# EAGLE design WT (EAGLE 9.0.1)
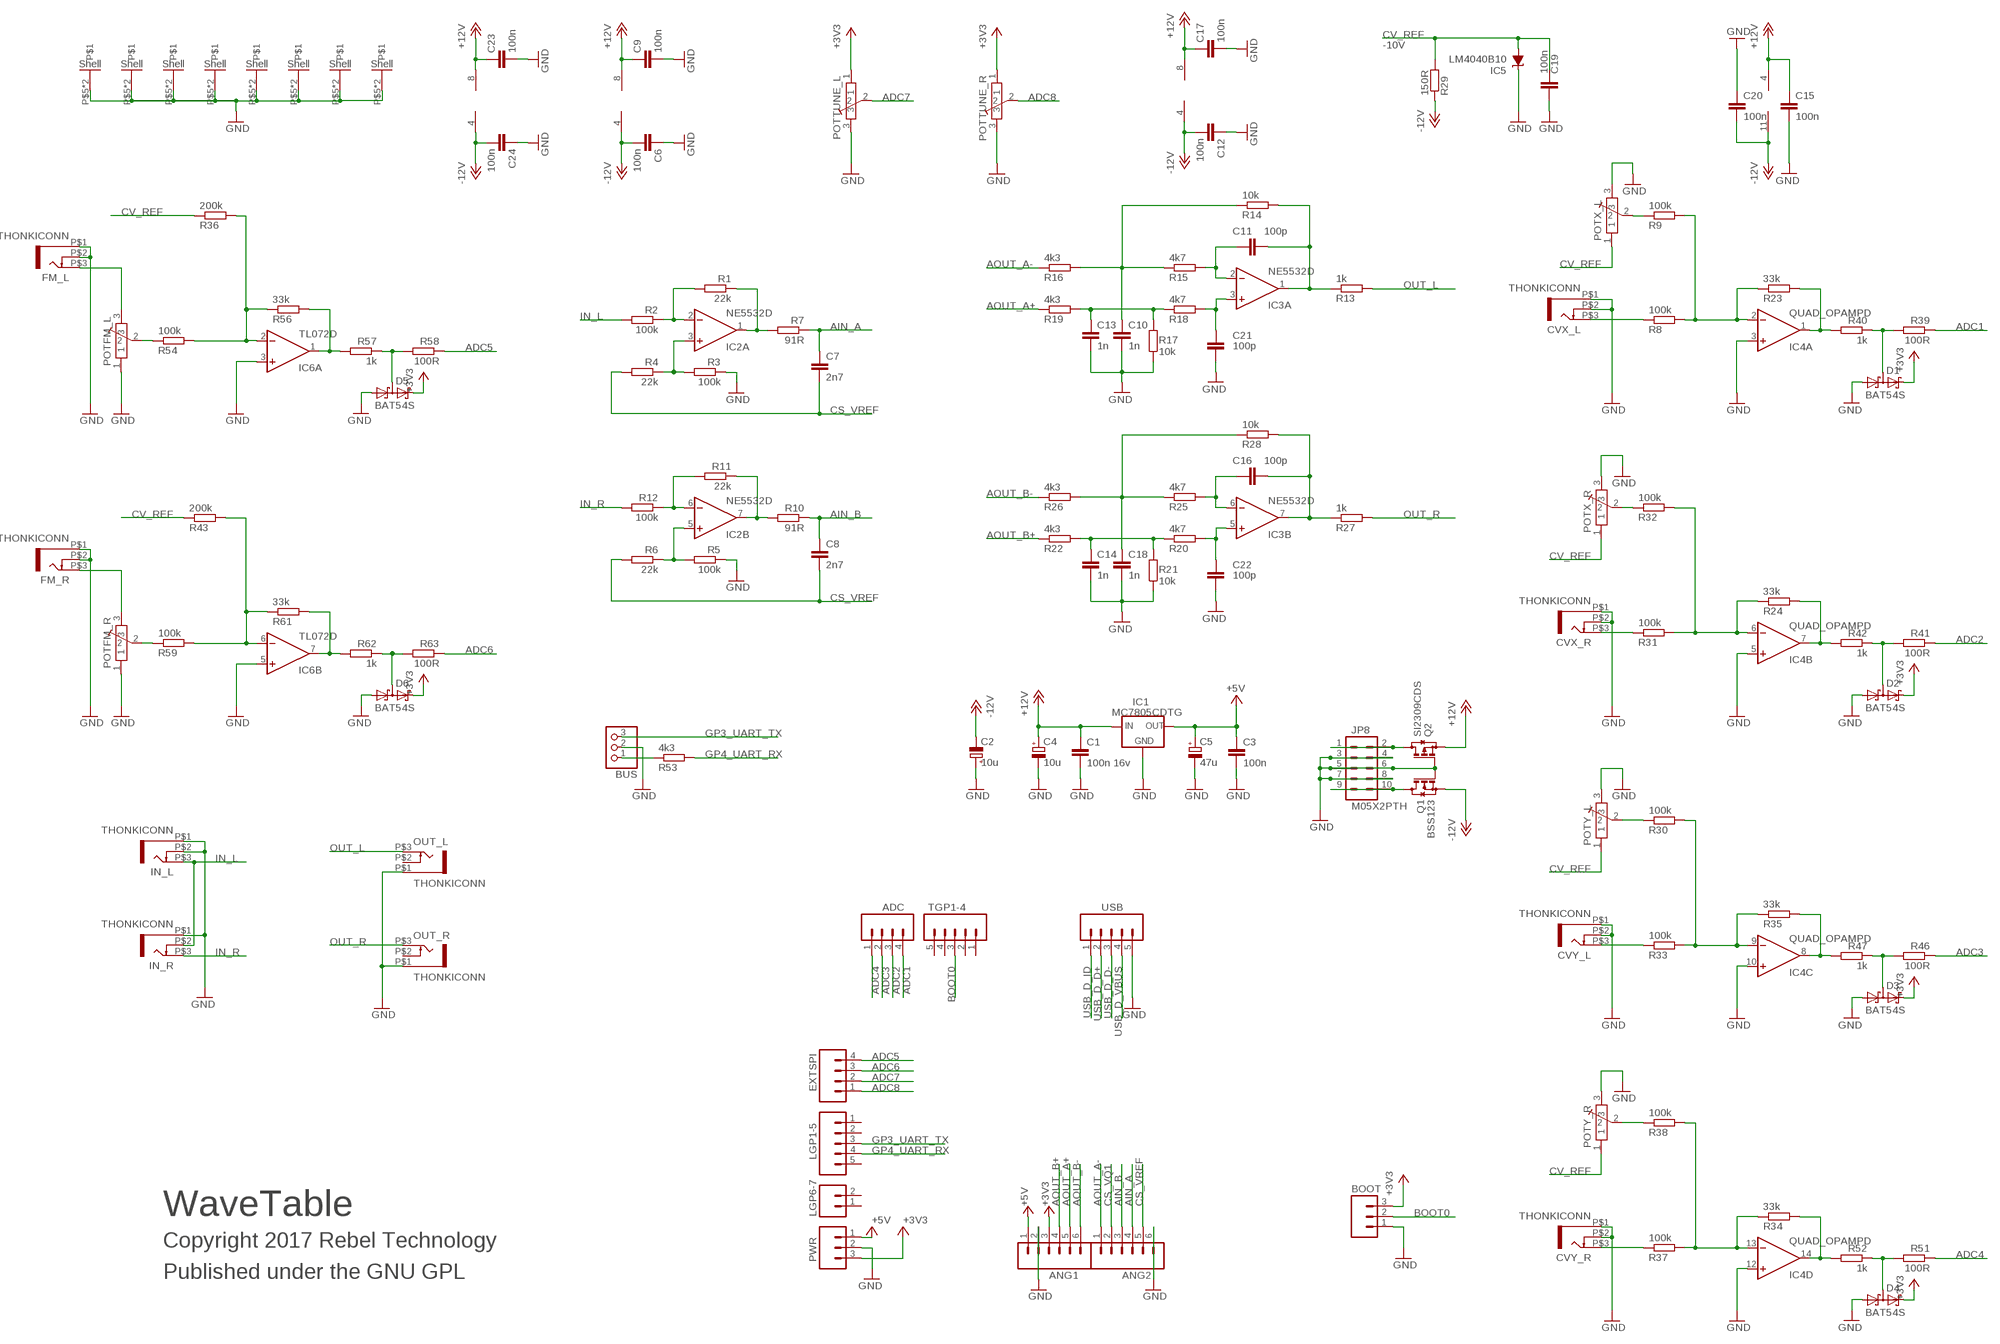
[diagram p0: schematic, sheet 1]

## Parts
ADC  M04PTH  [1X04]
ANG1  M06SIP  [1X06]
ANG2  M06SIP  [1X06]
BOOT  M03PTH  [1X03]
BUS  CON-JST-1X03PH-TH  [JST-B3B-PH-KL]
C1  100n 16v  C-EUC0603  [C0603]
C2  10u  CPOL-EU153CLV-0505  [CPOL-5]
C3  100n  C-EUC0603  [C0603]
C4  10u  CPOL-EU153CLV-0505  [CPOL-5]
C5  47u  CPOL-EUC  [PANASONIC_C]
C6  100n  C-EUC0603  [C0603]
C7  2n7  C-EUC0603  [C0603]
C8  2n7  C-EUC0603  [C0603]
C9  100n  C-EUC0603  [C0603]
C10  1n  C-EUC0603  [C0603]
C11  100p  C-EUC0603  [C0603]
C12  100n  C-EUC0603  [C0603]
C13  1n  C-EUC0603  [C0603]
C14  1n  C-EUC0603  [C0603]
C15  100n  C-EUC0603  [C0603]
C16  100p  C-EUC0603  [C0603]
C17  100n  C-EUC0603  [C0603]
C18  1n  C-EUC0603  [C0603]
C19  100n  C-EUC0603  [C0603]
C20  100n  C-EUC0603  [C0603]
C21  100p  C-EUC0603  [C0603]
C22  100p  C-EUC0603  [C0603]
C23  100n  C-EUC0603  [C0603]
C24  100n  C-EUC0603  [C0603]
CVX_L  THONKICONN  [THONKICONN]
CVX_R  THONKICONN  [THONKICONN]
CVY_L  THONKICONN  [THONKICONN]
CVY_R  THONKICONN  [THONKICONN]
D1  BAT54S  [SOT23]
D2  BAT54S  [SOT23]
D3  BAT54S  [SOT23]
D4  BAT54S  [SOT23]
D5  BAT54S  [SOT23]
D6  BAT54S  [SOT23]
EXTSPI  M04PTH  [1X04]
FM_L  THONKICONN  [THONKICONN]
FM_R  THONKICONN  [THONKICONN]
IC1  MC7805CDTG  MC78XX  [DPACK]
IC2  NE5532D  [SO08]
IC3  NE5532D  [SO08]
IC4  QUAD_OPAMPD  [SO14]
IC5  LM4040B10  LM4041C12DBZ  [DBZ_R-PDSO-G3]
IC6  TL072D  [SO08]
IN_L  THONKICONN  [THONKICONN]
IN_R  THONKICONN  [THONKICONN]
JP8  M05X2PTH  [AVR_ICSP]
LGP1-5  M05PTH  [1X05]
LGP6-7  M02PTH  [1X02]
OUT_L  THONKICONN  [THONKICONN]
OUT_R  THONKICONN  [THONKICONN]
POTFM_L  POT-ALPS-RK09L1140  [POT-ALPS-RK09L1140]
POTFM_R  POT-ALPS-RK09L1140  [POT-ALPS-RK09L1140]
POTTUNE_L  POT-ALPS-RK09L1140  [POT-ALPS-RK09L1140]
POTTUNE_R  POT-ALPS-RK09L1140  [POT-ALPS-RK09L1140]
POTX_L  POT-ALPS-RK09L1140  [POT-ALPS-RK09L1140]
POTX_R  POT-ALPS-RK09L1140  [POT-ALPS-RK09L1140]
POTY_L  POT-ALPS-RK09L1140  [POT-ALPS-RK09L1140]
POTY_R  POT-ALPS-RK09L1140  [POT-ALPS-RK09L1140]
PWR  M03PTH  [1X03]
Q1  BSS123  [SOT23]
Q2  SI2309CDS  BSS84  [SOT23]
R1  22k  R-EU_0603  [0603]
R2  100k  R-EU_0603  [0603]
R3  100k  R-EU_0603  [0603]
R4  22k  R-EU_0603  [0603]
R5  100k  R-EU_0603  [0603]
R6  22k  R-EU_0603  [0603]
R7  91R  R-EU_0603  [0603]
R8  100k  R-EU_0603  [0603]
R9  100k  R-EU_0603  [0603]
R10  91R  R-EU_0603  [0603]
R11  22k  R-EU_0603  [0603]
R12  100k  R-EU_0603  [0603]
R13  1k  R-EU_0603  [0603]
R14  10k  R-EU_0603  [0603]
R15  4k7  R-EU_0603  [0603]
R16  4k3  R-EU_0603  [0603]
R17  10k  R-EU_0603  [0603]
R18  4k7  R-EU_0603  [0603]
R19  4k3  R-EU_0603  [0603]
R20  4k7  R-EU_0603  [0603]
R21  10k  R-EU_0603  [0603]
R22  4k3  R-EU_0603  [0603]
R23  33k  R-EU_0603  [0603]
R24  33k  R-EU_0603  [0603]
R25  4k7  R-EU_0603  [0603]
R26  4k3  R-EU_0603  [0603]
R27  1k  R-EU_0603  [0603]
R28  10k  R-EU_0603  [0603]
R29  150R  R-EU_0603  [0603]
R30  100k  R-EU_0603  [0603]
R31  100k  R-EU_0603  [0603]
R32  100k  R-EU_0603  [0603]
R33  100k  R-EU_0603  [0603]
R34  33k  R-EU_0603  [0603]
R35  33k  R-EU_0603  [0603]
R36  200k  R-EU_0603  [0603]
R37  100k  R-EU_0603  [0603]
R38  100k  R-EU_0603  [0603]
R39  100R  R-EU_0603  [0603]
R40  1k  R-EU_0603  [0603]
R41  100R  R-EU_0603  [0603]
R42  1k  R-EU_0603  [0603]
R43  200k  R-EU_0603  [0603]
R46  100R  R-EU_0603  [0603]
R47  1k  R-EU_0603  [0603]
R51  100R  R-EU_0603  [0603]
R52  1k  R-EU_0603  [0603]
R53  4k3  R-EU_0603  [0603]
R54  100k  R-EU_0603  [0603]
R56  33k  R-EU_0603  [0603]
R57  1k  R-EU_0603  [0603]
R58  100R  R-EU_0603  [0603]
R59  100k  R-EU_0603  [0603]
R61  33k  R-EU_0603  [0603]
R62  1k  R-EU_0603  [0603]
R63  100R  R-EU_0603  [0603]
TGP1-4  M05PTH  [1X05]
USB  M05PTH  [1X05]

## Nets
+3V3: ANG1.3 BOOT.3 D1.2(C2) D2.2(C2) D3.2(C2) D4.2(C2) D5.2(C2) D6.2(C2) POTTUNE_L.1 POTTUNE_R.1 PWR.3
+5V: ANG1.1 C3.1 C5.+ IC1.3(OUT) PWR.1
+12V: C1.1 C4.+ C9.1 C15.1 C17.1 C23.1 IC1.1(IN) IC2.8(P:V+) IC3.8(P:V+) IC4.4(P:V+) IC6.8(P:V+) Q2.2(S)
-12V: C2.- C6.2 C12.2 C20.2 C24.2 IC2.4(P:V-) IC3.4(P:V-) IC4.11(P:V-) IC6.4(P:V-) Q1.2(S) R29.1
ADC1: ADC.4 R39.1
ADC2: ADC.3 R41.1
ADC3: ADC.2 R46.1
ADC4: ADC.1 R51.1
ADC5: EXTSPI.4 R58.1
ADC6: EXTSPI.3 R63.1
ADC7: EXTSPI.2 POTTUNE_L.2
ADC8: EXTSPI.1 POTTUNE_R.2
AIN_A: ANG2.4 C7.1 R7.1
AIN_B: ANG2.3 C8.1 R10.1
AOUT_A+: ANG1.5 R19.1
AOUT_A-: ANG2.1 R16.1
AOUT_B+: ANG1.4 R22.1
AOUT_B-: ANG1.6 R26.1
BOOT0: BOOT.2 TGP1-4.3
CS_VQ1: ANG2.2
CS_VREF: ANG2.5 C7.2 C8.2 R4.2 R6.2
CV_REF: C19.1 IC5.2(A) POTX_L.1 POTX_R.1 POTY_L.1 POTY_R.1 R29.2 R36.1 R43.1
EXT_UART_RX: BUS.1 R53.1
GND: ANG1.2 ANG2.6 BOOT.1 BUS.2 C1.2 C2.+ C3.2 C4.- C5.- C6.1 C9.2 C10.2 C12.1 C13.2 C14.2 C15.2 C17.2 C18.2 C19.2 C20.1 C21.2 C22.2 C23.2 C24.1 CVX_L.P$1 CVX_L.P$2 CVX_R.P$1 CVX_R.P$2 CVY_L.P$1 CVY_L.P$2 CVY_R.P$1 CVY_R.P$2 D1.1(A1) D2.1(A1) D3.1(A1) D4.1(A1) D5.1(A1) D6.1(A1) FM_L.P$1 FM_L.P$2 FM_R.P$1 FM_R.P$2 IC1.4(GND) IC4.3(A:+IN) IC4.5(B:+IN) IC4.10(C:+IN) IC4.12(D:+IN) IC5.1(C) IC6.3(A:+IN) IC6.5(B:+IN) IN_L.P$1 IN_L.P$2 IN_R.P$1 JP8.3 JP8.4 JP8.5 JP8.6 JP8.7 JP8.8 OUT_L.P$1 OUT_R.P$1 POTFM_L.1 POTFM_L.P$5 POTFM_L.P$6 POTFM_R.1 POTFM_R.P$5 POTFM_R.P$6 POTTUNE_L.3 POTTUNE_L.P$5 POTTUNE_L.P$6 POTTUNE_R.3 POTTUNE_R.P$5 POTTUNE_R.P$6 POTX_L.3 POTX_L.P$5 POTX_L.P$6 POTX_R.3 POTX_R.P$5 POTX_R.P$6 POTY_L.3 POTY_L.P$5 POTY_L.P$6 POTY_R.3 POTY_R.P$5 POTY_R.P$6 PWR.2 Q1.1(G) Q2.1(G) R3.1 R5.1 R17.1 R21.1 USB.5
GP3_UART_TX: BUS.3 LGP1-5.3
GP4_UART_RX: LGP1-5.4 R53.2
IN_L: IN_L.P$3 IN_R.P$2 R2.2
IN_R: IN_R.P$3 R12.2
N$1: IC2.1(A:OUT) R1.1 R7.2
N$2: IC2.3(A:+IN) R3.2 R4.1
N$3: CVX_L.P$3 R8.1
N$4: IC2.5(B:+IN) R5.2 R6.1
N$5: IC2.6(B:-IN) R11.2 R12.1
N$6: IC4.9(C:-IN) R30.2 R33.2 R35.1
N$7: C11.1 IC3.2(A:-IN) R15.2
N$8: JP8.9 JP8.10 Q1.3(D)
N$9: IC2.2(A:-IN) R1.2 R2.1
N$10: IC2.7(B:OUT) R10.2 R11.1
N$11: C21.1 IC3.3(A:+IN) R18.2
N$12: JP8.1 JP8.2 Q2.3(D)
N$13: IC4.2(A:-IN) R8.2 R9.2 R23.1
N$14: POTX_L.2 R9.1
N$15: C13.1 R17.2 R18.1 R19.2
N$16: D1.3(C1A2) R39.2 R40.1
N$17: IC4.1(A:OUT) R23.2 R40.2
N$18: C16.2 IC3.7(B:OUT) R27.1 R28.2
N$19: CVX_R.P$3 R31.1
N$20: IC4.6(B:-IN) R24.1 R31.2 R32.2
N$21: POTX_R.2 R32.1
N$22: IC4.7(B:OUT) R24.2 R42.2
N$23: D2.3(C1A2) R41.2 R42.1
N$24: C18.1 R25.1 R26.2 R28.1
N$25: CVY_L.P$3 R33.1
N$26: C16.1 IC3.6(B:-IN) R25.2
N$27: POTY_L.2 R30.1
N$28: IC4.8(C:OUT) R35.2 R47.2
N$29: D3.3(C1A2) R46.2 R47.1
N$30: C22.1 IC3.5(B:+IN) R20.2
N$31: CVY_R.P$3 R37.1
N$32: C14.1 R20.1 R21.2 R22.2
N$33: IC4.13(D:-IN) R34.1 R37.2 R38.2
N$34: POTY_R.2 R38.1
N$35: IC4.14(D:OUT) R34.2 R52.2
N$36: D4.3(C1A2) R51.2 R52.1
N$39: C11.2 IC3.1(A:OUT) R13.1 R14.2
N$41: C10.1 R14.1 R15.1 R16.2
N$45: POTFM_L.2 R54.1
N$47: IC6.1(A:OUT) R56.2 R57.2
N$48: D5.3(C1A2) R57.1 R58.2
N$49: POTFM_R.2 R59.1
N$50: IC6.6(B:-IN) R43.2 R59.2 R61.1
N$51: FM_R.P$3 POTFM_R.3
N$52: IC6.7(B:OUT) R61.2 R62.2
N$53: D6.3(C1A2) R62.1 R63.2
N$54: IC6.2(A:-IN) R36.2 R54.2 R56.1
N$57: FM_L.P$3 POTFM_L.3
OUT_L: OUT_L.P$3 R13.2
OUT_R: OUT_R.P$3 R27.2
USB_D_D+: USB.2
USB_D_D-: USB.3
USB_D_ID: USB.1
USB_D_VBUS: USB.4
Unconnected: LGP1-5.1 LGP1-5.2 LGP1-5.5 LGP6-7.1 LGP6-7.2 OUT_L.P$2 OUT_R.P$2 TGP1-4.1 TGP1-4.2 TGP1-4.4 TGP1-4.5

## Notes on the sheet
- -10V
- WaveTable
- Copyright 2017 Rebel Technology
- Published under the GNU GPL

## Library data of the parts
ADC EXTSPI = SparkFun:M04: Header 4 Standard 4-pin 0.1" header. Use with straight break away headers (SKU : PRT-00116), right angle break away headers (PRT-00553), swiss pins (PRT-00743), machine pins (PRT-00117), and female headers (PRT-00115). Molex polarized connector foot print use with SKU : PRT-08231 with associated crimp pins and housings. 1MM SMD Version SKU: PRT-10208
ANG1 ANG2 = SparkFun:M06: Header 6 Standard 6-pin 0.1" header. Use with straight break away headers (SKU : PRT-00116), right angle break away headers (PRT-00553), swiss pins (PRT-00743), machine pins (PRT-00117), and female headers (PRT-00115). Molex polarized connector foot print use with SKU : PRT-08094 with associated crimp pins and housings. NOTES ON THE VARIANTS LOCK and LOCK_LONGPADS... This footprint was designed to help hold the alignment of a through-hole component (i.e. 6-pin header) while soldering it into place. You may notice that each hole has been shifted either up or down by 0.005 of an inch from it's more standard position (which is a perfectly straight line). This slight alteration caused the pins (the squares in the middle) to touch the edges of the holes. Because they are alternating, it causes a "brace" to hold the component in place. 0.005 has proven to be the perfect amount of "off-center" position when using our standard breakaway headers. Although looks a little odd when you look at the bare footprint, once you have a header in there, the alteration is very hard to notice. Also, if you push a header all the way into place, it is covered up entirely on the bottom side. This idea of altering the position of holes to aid alignment will be further integrated into the Sparkfun Library for other footprints. It can help hold any component with 3 or more connection pins.
BOOT PWR = SparkFun:M03: Header 3 Standard 3-pin 0.1" header. Use with straight break away headers (SKU : PRT-00116), right angle break away headers (PRT-00553), swiss pins (PRT-00743), machine pins (PRT-00117), and female headers (PRT-00115). Molex polarized connector foot print use with SKU : PRT-08232 with associated crimp pins and housings.
BUS = Rebel:CON-JST-1X03
C1 C3 = Rebel:C-EU: CAPACITOR, European symbol
C2 C4 = Rebel:CPOL-EU: POLARIZED CAPACITOR, European symbol
C5 = rcl:CPOL-EU: POLARIZED CAPACITOR, European symbol
C6-C24 = resistor:C-EU: CAPACITOR, European symbol
CVX_L CVX_R CVY_L CVY_R FM_L FM_R IN_L IN_R OUT_L OUT_R = Rebel:THONKICONN
D1-D6 = diode:BAT54S: Schottky Diodes Pin connection corrected 2011-05-04 Source: Fairchild .. BAT54.pdf
IC1 = James:MC78XX: VOLTAGE REGULATOR; OC_FARNELL: 2296028
IC2 IC3 = linear:NE5532: AUDIO AMPLIFIER
IC4 = adafruit:QUAD_OPAMP: OP AMP Standard quad package
IC5 = texas:LM4041: PRECISION MICROPOWER SHUNT VOLTAGE REFERENCE Source: http://focus.ti.com/lit/ds/slcs146e/slcs146e.pdf; MF: TEXAS INSTRUMENT CONNECTORS; MPN: LM4041C12QDBZT; OC_FARNELL: 1771733; OC_NEWARK: 43K3376
IC6 = linear:TL072: OP AMP
JP8 = SparkFun:M05X2: Header 5x2 Standard 10-pin dual row 0.1" header. Commonly used with AVR-ISP. Use with Spark Fun Electronics SKU: PRT-00778
LGP1-5 TGP1-4 USB = SparkFun:M05: Header 5 Standard 5-pin 0.1" header. Use with straight break away headers (SKU : PRT-00116), right angle break away headers (PRT-00553), swiss pins (PRT-00743), machine pins (PRT-00117), and female headers (PRT-00115). Molex polarized connector foot print use with SKU : PRT-08230 with associated crimp pins and housings.
LGP6-7 = SparkFun:M02: Header 2 Standard 2-pin 0.1" header. Use with straight break away headers (SKU : PRT-00116), right angle break away headers (PRT-00553), swiss pins (PRT-00743), machine pins (PRT-00117), and female headers (PRT-00115). Molex polarized connector foot print use with SKU : PRT-08233 with associated crimp pins and housings.
POTFM_L POTFM_R POTTUNE_L POTTUNE_R POTX_L POTX_R POTY_L POTY_R = Rebel:POT-ALPS-RK09L
Q1 = transistor-small-signal:BSS123: N-CHANNEL MOS FET; OC_FARNELL: 1843725
Q2 = transistor-small-signal:BSS84: P-CHANNEL MOS FET; OC_FARNELL: 1779264
R1-R43 R46 R47 R51-R54 R56-R59 R61-R63 = Rebel:R-EU_: RESISTOR, European symbol

## Net classes
1 power: width 0.178 mm, drill 0.305 mm, clearance 0.178 mm to class 0, clearance 0.178 mm

## Board
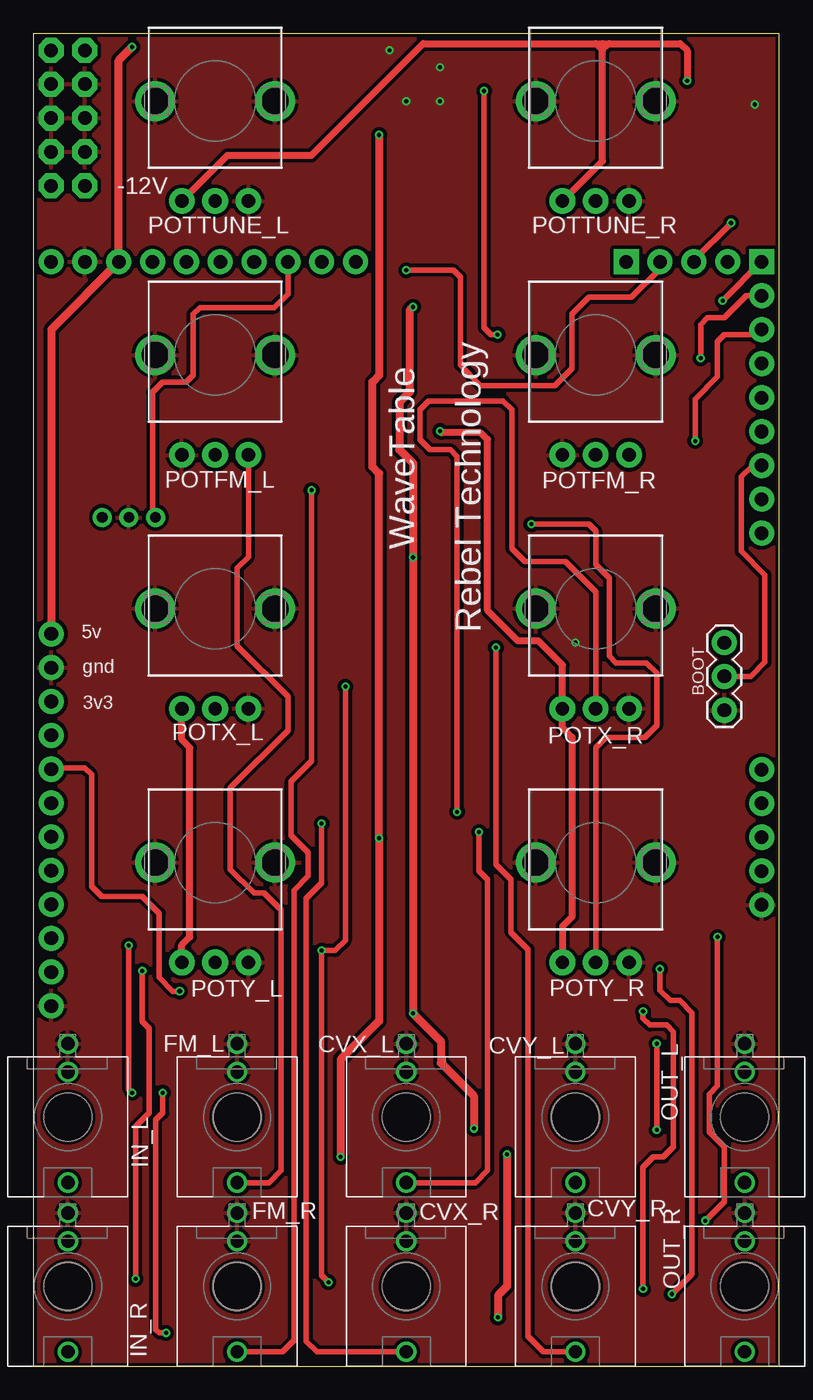
[diagram p1: board, top side]
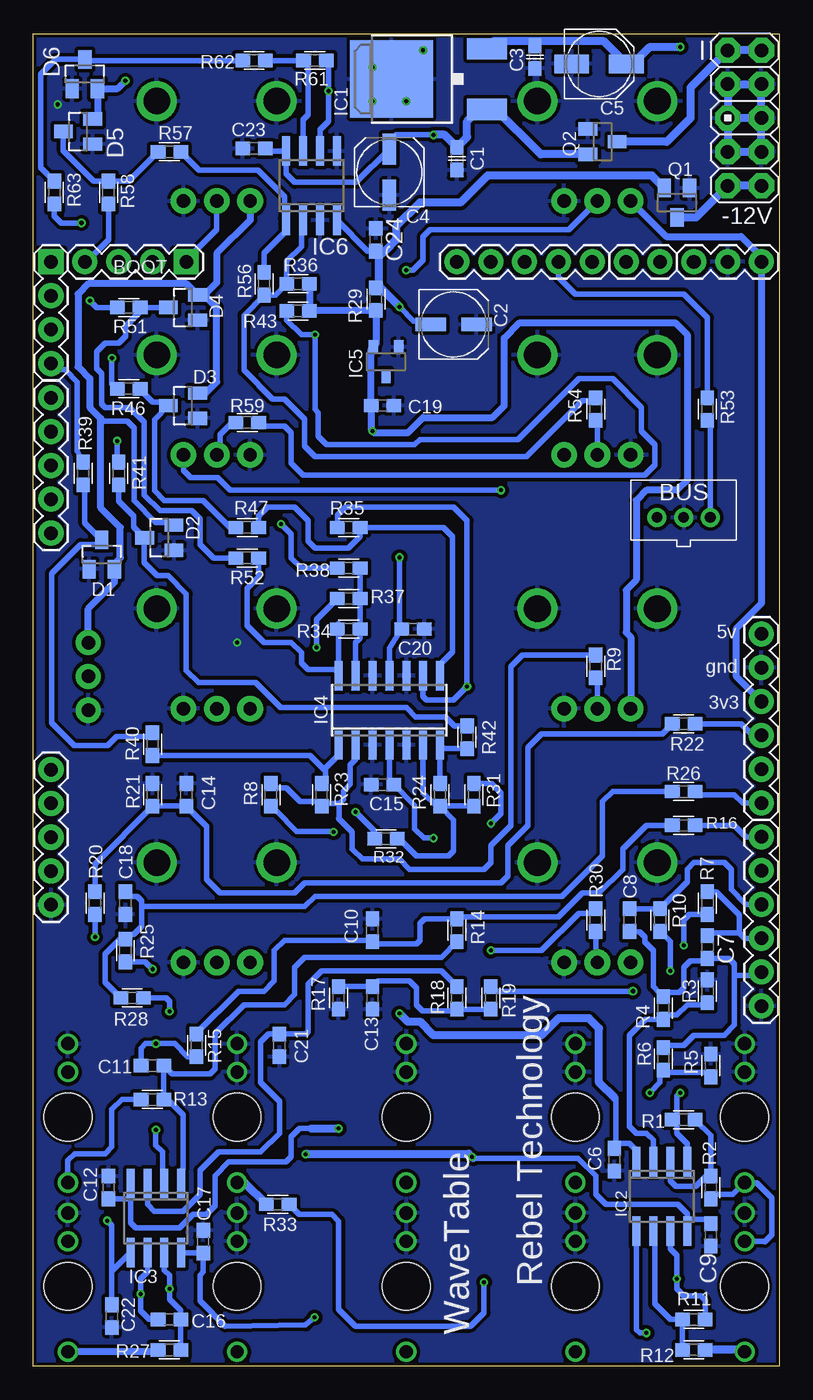
[diagram p2: board, bottom side, seen from below]

Size 56 x 100 mm. Coordinates in mm from the lower left corner, seen from the top.
Outline: 0,0 56,0 56,100 0,100 0,0
Copper layers (1*16): Top 0.035mm / dielectric 1.5mm / Bottom 0.035mm
Design rules "SeeedStudio_2layer_DRU_no_angle_20140221 *": minimum track width 10mil, minimum drill 12mil, track to track 11mil, track to pad 11mil, pad to pad 10mil, via to via 10mil, smd to smd 0mil, copper to edge 10mil, drill to drill 10mil, minimum pad ring 10mil, minimum via ring 6mil, stop-mask expansion 2mil, vias tented up to drill 100mil, thermal gap 10mil

### Footprints (pad centres in the part's own frame; a part is rotated, then mirrored left to right if it is on the bottom)
1X04 = drill 1.016 pad 1.88 square: 1 0,0 | drill 1.016 pad 1.88: 2 2.54,0; 3 5.08,0; 4 7.62,0
1X06 = drill 1.016 pad 1.88: 1 0,0; 2 2.54,0; 3 5.08,0; 4 7.62,0; 5 10.16,0; 6 12.7,0
1X03 = drill 1.016 pad 1.88: 1 0,0; 2 2.54,0; 3 5.08,0
JST-B3B-PH-KL = drill 0.8 pad 1.422: 1 2,0; 2 0,0; 3 -2,0
C0603 = smd 1.1 x 1: 1 -0.85,0; 2 0.85,0
CPOL-5 = smd 2.3 x 1: + 1.725,0; - -1.725,0
PANASONIC_C = smd 2.6 x 1.4: + 2.05,0; - -2.05,0
THONKICONN = drill 1: P$1 0,-5.5; P$2 0,-3.38; P$3 0,4.92 | hole 3.6: 0,0
SOT23 = smd 1 x 1.4: 1 -0.95,-1.1; 2 0.95,-1.1; 3 0,1.1
DPACK = smd 1.6 x 3: 1 -2.28,-4.8; 3 2.28,-4.8 | smd 5.8 x 6.2: 4 0,2.38
SO08 = smd 0.6 x 2.2: 1 -1.905,-2.6; 2 -0.635,-2.6; 3 0.635,-2.6; 4 1.905,-2.6; 5 1.905,2.6; 6 0.635,2.6; 7 -0.635,2.6; 8 -1.905,2.6
SO14 = smd 0.6 x 2.2: 1 -3.81,-2.6; 2 -2.54,-2.6; 3 -1.27,-2.6; 4 0,-2.6; 5 1.27,-2.6; 6 2.54,-2.6; 7 3.81,-2.6; 8 3.81,2.6; 9 2.54,2.6; 10 1.27,2.6; 11 0,2.6; 12 -1.27,2.6; 13 -2.54,2.6; 14 -3.81,2.6
DBZ_R-PDSO-G3 = smd 0.7 x 1: 1 -0.95,-1.1; 2 0.95,-1.1; 3 0,1.1
AVR_ICSP = drill 1.016 pad 1.88 octagon: 1 -1.27,5.08; 2 1.27,5.08; 3 -1.27,2.54; 4 1.27,2.54; 5 -1.27,0; 6 1.27,0; 7 -1.27,-2.54; 8 1.27,-2.54; 9 -1.27,-5.08; 10 1.27,-5.08
1X05 = drill 1.016 pad 1.88: 1 0,0; 2 2.54,0; 3 5.08,0; 4 7.62,0; 5 10.16,0
1X02 = drill 1.016 pad 1.88: 1 0,0; 2 2.54,0
POT-ALPS-RK09L1140 = drill 1 pad 1.93: 1 -2.5,-7.5; 2 0,-7.5; 3 2.5,-7.5 | drill 2: P$5 -4.5,0; P$6 4.5,0
0603 = smd 1.1 x 1: 1 -0.85,0; 2 0.85,0

### Placement (x,y rotation side)
ADC  54.67,82.88 270 bottom
ANG1  1.35,54.97 270 bottom
ANG2  1.35,39.74 270 bottom
BOOT  51.88,49.23 90 top
BUS  7.17,63.71 0 bottom
C1  24.19,90.63 270 bottom
C2  24.44,78.19 0 bottom
C3  18.35,98.25 270 bottom
C4  29.27,89.62 90 bottom
C5  13.52,97.74 0 bottom
C6  12.38,15.51 90 bottom
C7  5.39,31.45 270 bottom
C8  11.24,33.48 270 bottom
C9  5.14,9.86 270 bottom
C10  30.54,32.72 90 bottom
C11  47.05,22.56 0 bottom
C12  50.35,13.42 270 bottom
C13  30.54,27.64 270 bottom
C14  44.51,42.88 90 bottom
C15  29.78,43.64 180 bottom
C16  45.78,3.51 0 bottom
C17  43.24,9.35 90 bottom
C18  49.08,34.75 270 bottom
C19  29.78,72.09 0 bottom
C20  27.49,55.33 180 bottom
C21  37.53,24.08 270 bottom
C22  50.1,3.76 270 bottom
C23  39.43,91.39 180 bottom
C24  30.29,84.54 270 bottom
CVX_L  28,18.7 180 top
CVX_R  28,6 180 top
CVY_L  40.7,18.7 180 top
CVY_R  40.7,6 180 top
D1  50.86,60.91 0 bottom
D2  46.54,62.18 90 bottom
D3  44.76,72.09 90 bottom
D4  44.76,79.46 90 bottom
D5  52.64,92.66 90 bottom
D6  52.13,96.98 0 bottom
EXTSPI  44.51,82.88 180 bottom
FM_L  15.3,18.7 180 top
FM_R  15.3,6 180 top
IC1  26.73,96.6 90 bottom
IC2  8.81,12.75 180 bottom
IC3  46.8,11.13 180 bottom
IC4  29.27,49.23 0 bottom
IC5  29.52,75.39 180 bottom
IC6  35.11,88.6 0 bottom
IN_L  2.6,18.7 180 top
IN_R  2.6,6 180 top
JP8  2.6,93.68 0 bottom
LGP1-5  24.2,82.88 0 bottom
LGP6-7  8.95,82.88 180 bottom
OUT_L  53.4,18.7 180 top
OUT_R  53.4,6 180 top
POTFM_L  13.65,75.9 0 top
POTFM_R  42.22,75.9 0 top
POTTUNE_L  13.65,94.95 0 top
POTTUNE_R  42.22,94.95 0 top
POTX_L  13.65,56.85 0 top
POTX_R  42.22,56.85 0 top
POTY_L  13.65,37.8 0 top
POTY_R  42.22,37.8 0 top
PWR  6.41,82.88 0 bottom
Q1  7.68,87.33 180 bottom
Q2  13.27,91.9 270 bottom
R1  7.17,18.5 0 bottom
R2  5.14,13.42 270 bottom
R3  5.39,28.15 270 bottom
R4  8.7,26.88 90 bottom
R5  5.14,22.56 270 bottom
R6  8.7,23.07 90 bottom
R7  5.39,34.75 270 bottom
R8  38.16,42.88 90 bottom
R9  13.78,52.53 90 bottom
R10  8.95,33.48 270 bottom
R11  6.41,3.51 180 bottom
R12  6.41,1.22 0 bottom
R13  47.05,20.02 180 bottom
R14  24.19,32.72 270 bottom
R15  43.75,24.08 270 bottom
R16  7.17,40.59 180 bottom
R17  33.08,27.64 90 bottom
R18  24.19,27.64 90 bottom
R19  21.65,27.64 270 bottom
R20  51.37,34.75 270 bottom
R21  47.05,42.88 270 bottom
R22  7.17,48.21 180 bottom
R23  34.35,42.88 90 bottom
R24  25.46,42.88 90 bottom
R25  49.08,31.2 270 bottom
R26  7.17,43.13 180 bottom
R27  45.78,1.22 180 bottom
R28  48.57,27.64 0 bottom
R29  30.29,80.09 270 bottom
R30  13.78,33.48 90 bottom
R31  22.92,42.88 270 bottom
R32  29.52,39.58 0 bottom
R33  37.65,12.15 0 bottom
R34  32.32,55.33 180 bottom
R35  32.32,62.95 0 bottom
R36  36.13,81.23 180 bottom
R37  32.32,57.61 0 bottom
R38  32.32,59.9 0 bottom
R39  52.26,67.01 270 bottom
R40  47.05,46.69 270 bottom
R41  49.59,67.01 270 bottom
R42  23.43,47.2 270 bottom
R43  36.13,79.2 180 bottom
R46  48.83,73.36 0 bottom
R47  39.94,62.95 0 bottom
R51  48.83,79.46 0 bottom
R52  39.94,60.66 0 bottom
R53  5.39,71.84 90 bottom
R54  13.78,71.84 90 bottom
R56  38.67,81.23 90 bottom
R57  45.78,91.14 0 bottom
R58  50.35,88.09 90 bottom
R59  39.94,70.82 0 bottom
R61  34.86,98 180 bottom
R62  39.43,98 0 bottom
R63  54.42,88.09 90 bottom
TGP1-4  54.67,62.53 90 bottom
USB  54.67,44.78 270 bottom

### Tracks (layer width: path | path; a pad name or v marks a point on that pad's centre or on a via)
+3V3  (via drill 0.3)
  Top 0.406: 42.73,98.76 42.73,99.27 | 42.22,99.27 42.73,98.76 | 42.73,98.76 43.24,99.27
  Top 0.508: POTTUNE_L.1 14.59,90.89 20.89,90.89 29.27,99.27 42.22,99.27 42.73,99.27 43.24,99.27 48.57,99.27 49.08,98.76 v49.08,96.47 | POTTUNE_R.1 42.73,90.46 42.73,98.76
  Bottom 0.406: 1.33,83.27 PWR.3 | 51.18,93.97 D5.2 | 43.05,73.04 D3.2 | 50.92,71.14 50.73,70.95 | 50.73,70.95 48.96,70.95 48.42,70.41 48.42,64.95 46.8,63.33 45.64,63.33 D2.2 | D1.2 49.91,60.21 | 50.92,70.76 50.73,70.95 | 42.94,80.63 43.16,80.41 D4.2 43.17,80.41 42.94,80.17 42.94,80.63
  Bottom 0.508: PWR.3 1.33,57.25 3.26,55.33 3.26,51.8 ANG1.3 | POTTUNE_L.1 8.49,84.79 2.85,84.79 1.33,83.27 | POTTUNE_R.1 39.72,86.02 42.22,83.52 42.22,81.34 42.94,80.63 | 51.18,93.97 D6.2 49.67,95.88 v49.08,96.47 | 43.05,73.04 42.22,73.87 42.22,79.46 42.94,80.17 | D1.2 49.91,58.82 51.88,56.85 BOOT.3 | D4.2 44.49,81.23 51.88,81.23 52.64,80.47 52.64,75.01 51.75,74.12 51.75,71.96 50.92,71.14 50.92,70.76 50.92,64.41 49.46,62.95 49.46,60.66 49.91,60.21
+5V  (via drill 0.3)
  Top 0.61: ANG1.1 1.34,77.82 PWR.1 6.41,98 v7.43,99.01
  Bottom 0.61: 21.9,99.01 21.48,99.43 18.35,99.43 | 18.35,99.43 13.16,99.43 C5.+ 10.98,97.74 9.71,99.01 v7.43,99.01 | C3.1 18.35,99.43
  Bottom 0.66: 21.9,99.01 IC1.3
+12V  (via drill 0.3)
  Top 0.61: v25.97,92.41 25.97,74.38 25.46,73.87 25.46,67.52 25.97,67.01 v25.97,39.63 25.97,25.91 23.07,23.02 v23.07,15.7 | v34.88,3.66 34.88,5.31 35.57,6 v35.57,15.91
  Bottom 0.406: C1.1 24.33,91.34 | C23.1 38.39,91.2 IC6.8 37.02,89.49 36.38,88.85 31.76,88.85 C4.+ 29.27,91.9 28.76,92.41 v25.97,92.41 | IC4.4 29.27,43.64 C15.1 27.36,42.08 27.36,40.34 26.65,39.63 v25.97,39.63 | IC3.8 44.86,8.5 C17.1 43.24,7.07 43.49,6.81 43.49,4.91 41.59,3 35.54,3.1 v34.88,3.66 | 6.9,11.03 6.9,11.42 7.63,12.15 13.01,12.15 13.78,12.91 13.78,14.28 15.1,15.6 22.97,15.6 v23.07,15.7 | 6.9,11.03 IC2.8 | C9.1 5.46,11.03 6.9,11.03
  Bottom 0.61: Q2.2 17.91,90.95 21.4,94.45 IC1.1 22.41,94.45 23.43,93.43 23.43,92.24 C1.1 25.12,92.41 v25.97,92.41 | v35.57,15.91 35.52,15.96 23.33,15.96 22.97,15.6
-12V  (via drill 0.3)
  Top 0.61: v28.51,79.51 28.25,79.25 28.25,73.11 27.49,72.34 27.49,68.79 28.51,67.77 v28.51,60.71 v28.51,26.47 30.59,24.39 30.59,22.76 33.08,20.27 v33.08,17.84
  Bottom 0.406: IC6.4 30.89,83.69 C24.2 | IC4.11 29.27,53.89 C20.2 28.51,55.49 v28.51,60.71 | IC3.4 48.7,12.6 | 48.7,12.6 48.7,10.75 48.32,10.37 45.02,10.37 44,11.38 42.99,11.38 42.35,12.02 42.35,14.31 41.34,15.32 37.02,15.32 36.64,15.7 36.64,17.23 36.03,17.84 35.11,17.84 | 12.35,20.12 12.25,20.02 12.25,16.23 C6.2 12.01,16.72 11.24,16.72 10.71,16.19 IC2.4 | C12.2 48.74,12.57 48.7,12.6 | v28.51,79.51 27.44,78.44 26.42,78.44 C2.-
  Bottom 0.61: Q1.2 9.56,89.36 21.9,89.36 23.94,87.33 26.98,87.33 28.76,85.55 28.76,84.54 29.61,83.69 | 29.61,83.69 C24.2 | 29.61,83.69 30.03,83.27 30.03,81.19 R29.1 | R29.1 29.99,80.94 | R29.1 29.94,80.94 v28.51,79.51 | 35.11,17.84 v33.08,17.84 | v28.51,26.47 27.9,25.86 26.98,25.86 25.97,24.85 17.84,24.85 16.57,26.12 14.28,26.12 13.52,25.35 13.52,21.29 12.35,20.12
ADC1
  Bottom 0.406: ADC.4 54.19,74.78 53.6,74.78 52.69,73.87 52.69,68.67 R39.1
ADC2  (via drill 0.3)
  Top 0.406: v49.69,69.45 49.69,72.6 51.37,74.27 51.37,76.92 51.88,77.42 54.29,77.42 ADC.3
  Bottom 0.406: R41.1 49.69,67.96 v49.69,69.45
ADC3  (via drill 0.3)
  Top 0.406: 53.65,80.34 ADC.2 53.53,80.34 51.88,78.69 50.61,78.69 50.1,78.19 v50.1,75.65
  Bottom 0.406: R46.1 50.1,73.7 v50.1,75.65
ADC4  (via drill 0.3)
  Top 0.406: ADC.1 v51.75,79.96
  Bottom 0.406: R51.1 51.24,79.46 v51.75,79.96
ADC5
  Bottom 0.406: R58.1 50.35,84.54 52,82.88 EXTSPI.4
ADC6  (via drill 0.3)
  Top 0.406: v52.38,85.81 49.59,83.02 EXTSPI.3
  Bottom 0.406: R63.1 54.42,86.31 53.91,85.81 v52.38,85.81
ADC7  (via drill 0.3)
  Top 0.406: v28,82.25 31.56,82.25 32.06,81.74 32.06,75.14 33.59,73.61 39.18,73.61 40.45,74.88 40.45,78.95 41.72,80.22 44.92,80.22 47.05,82.36 EXTSPI.2
  Bottom 0.406: POTTUNE_L.2 15.8,85.3 26.22,85.3 26.73,84.79 26.73,83.01 27.49,82.25 v28,82.25
ADC8
  Bottom 0.406: POTTUNE_R.2 42.22,85.3 44.51,83.01 EXTSPI.1
AIN_A
  Bottom 0.406: ANG2.4 2.57,32.12 2.98,32.53 | R7.1 4.72,35.6 2.98,33.86 2.98,32.53 | 2.98,32.53 5.17,32.53 C7.1
AIN_B
  Bottom 0.406: ANG2.3 2.5,34.66 3.62,35.77 3.62,37.29 4.12,37.8 6.41,37.8 6.92,37.29 6.92,36.36 R10.1 C8.1
AOUT_A+  (via drill 0.35)
  Top 0.406: v10.98,28.15 10.47,28.15 9.46,29.16 9.46,33.99 8.19,35.26 5.14,35.26 4.38,36.02 4.38,44.4 3.87,44.91 1.45,44.91 ANG1.5
  Bottom 0.406: R19.1 21.31,28.15 v10.98,28.15
AOUT_A-
  Bottom 0.406: ANG2.1 2.5,39.74 3.36,40.59 R16.1
AOUT_B+
  Bottom 0.406: R22.1 2.85,48.21 1.99,47.35 ANG1.4
AOUT_B-
  Bottom 0.406: R26.1 6.07,42.88 3.36,42.88 2.75,42.27 ANG1.6
BOOT0
  Top 0.406: TGP1-4.3 54,67.61 53.15,66.76 53.15,61.17 54.92,59.39 54.92,52.84 53.86,51.77 BOOT.2
CS_VREF
  Bottom 0.406: ANG2.5 1.59,29.33 3.36,29.33 | C8.2 10.47,32.59 10.09,32.21 10.09,31.83 9.46,31.2 9.46,28.49 9.03,28.06 | 9.03,28.06 R4.2 8.56,27.73 | 3.36,29.33 3.36,25.61 4.12,24.85 6.41,24.85 7.17,24.08 8.53,24.08 R6.2 | 3.36,29.33 3.36,30.18 3.78,30.6 C7.2 5.56,30.43 6.66,30.43 7.17,29.93 7.17,28.4 7.51,28.06 9.03,28.06
CV_REF  (via drill 0.3)
  Top 0.508: POTY_L.1 11.15,31.62 11.74,32.21 11.74,46.44 11.15,47.03 POTX_L.1 | POTY_R.1 39.72,33.01 40.45,33.74 40.45,47.2 39.72,47.92 POTX_R.1 39.72,52.62 37.91,54.44 36.38,54.44 34.1,56.72 34.1,69.55 33.59,70.06 30.67,70.06 v30.54,70.19
  Bottom 0.406: R43.1 35.24,79.24 35.28,79.28 | 30.29,76.68 IC5.2 30.63,76.34 | 30.63,70.27 v30.54,70.19 30.41,70.06
  Bottom 0.508: 35.24,79.24 R29.2 30.29,76.68 | R36.1 35.28,79.28 | 30.63,76.34 C19.1 30.63,70.27 | 30.41,70.06 27.87,70.06 26.73,71.2 21.52,71.2 20.63,72.09 20.63,77.17 19.49,78.31 7.81,78.31 6.92,77.42 6.92,66.5 7.68,65.74 9.97,65.74 10.73,64.98 10.73,59.01 11.49,58.25 11.49,55.07 11.15,54.73 POTX_L.1
EXT_UART_RX
  Bottom 0.406: R53.1 5.17,70.76 BUS.1
GND  (via drill 0.3)
  Bottom 0.406: 54.16,94.8 v54.16,94.7 | IC1.4 29.65,96.6 v30.54,97.49
  Bottom 0.61: JP8.6 JP8.4 JP8.3 JP8.5 | JP8.5 JP8.7 JP8.8 JP8.6 | JP8.6 JP8.5
  other vias: 40.7,54.31 26.73,98.76 28,94.95 30.54,94.95
  pour Bottom: -2.1,-1 -2,101.27 58,101.27 58.5,-1.5
  pour Top: -2,-1 -1.9,101.27 57.85,101.27 57.75,-1
GP3_UART_TX
  Top 0.406: LGP1-5.3 19.11,80.47 18.09,79.46 12.51,79.46 12,78.95 12,74.38 11.49,73.87 9.71,73.87 8.95,73.11 8.95,63.93 BUS.3
GP4_UART_RX
  Bottom 0.406: LGP1-5.4 16.57,81.75 15.3,80.47 7.17,80.47 5.39,78.69 R53.2
IN_L
  Bottom 0.406: R2.2 4.8,12.91 3.47,12.91 IN_L.P$3 1.69,13.78 0.57,12.65 0.57,9.86 1.08,9.35 1.1,9.38 IN_R.P$2
  Bottom 0.61: IN_L.P$3 2.9,13.78
IN_R
  Bottom 0.61: IN_R.P$3 2.75,1.22 R12.2
N$1  (via drill 0.3)
  Top 0.406: v7.43,20.53 7.17,20.78 v7.17,31.58
  Bottom 0.406: IC2.1 6.9,16.7 7.68,17.48 7.68,18.15 R1.1 | R1.1 8.02,18.66 | R7.2 6.75,33.9 7.17,33.48 v7.17,31.58 | R1.1 7.68,18.84 7.68,20.27 v7.43,20.53
N$2
  Bottom 0.406: IC2.3 9.46,15.37 9.46,16.97 9.97,17.48 10.73,17.48 11.24,17.99 11.24,24.85 10.05,26.03 R4.1 8.35,26.37 7.68,26.37 6.92,27.13 5.56,27.13 R3.2
N$3  (via drill 0.3)
  Top 0.406: CVX_L.P$3 33.19,13.78 34.1,14.69 34.1,36.53 33.46,37.16 v33.46,40.09
  Bottom 0.406: R8.1 37.79,41.66 37.75,41.66 36.23,40.14 33.51,40.14 v33.46,40.09
N$4  (via drill 0.3)
  Top 0.406: v9.97,2.49 9.46,2.49 9.2,2.75 9.2,18.5 9.71,19 v9.71,20.53
  Bottom 0.406: v9.97,2.49 10.47,2.49 10.73,2.75 10.73,10.13 IC2.5 | R5.2 5.48,22.05 8.35,22.05 R6.1 8.95,21.96 8.95,21.29 v9.71,20.53
N$5
  Bottom 0.406: R12.1 R11.2 8.19,3.51 9.36,4.68 9.36,10.07 IC2.6
N$6  (via drill 0.3)
  Top 0.406: v22.16,6.3 21.65,6.81 v21.65,31.2 22.67,31.2 23.43,31.96 v23.43,51.01
  Bottom 0.406: R33.2 36.04,11.38 33.59,11.38 33.08,10.88 33.08,4.27 31.81,3 23.17,3 22.16,4.02 v22.16,6.3 | R35.1 33.17,63.87 32.57,64.47 24.44,64.47 23.43,63.45 v23.43,51.01 24.44,49.99 26.48,49.99 26.73,50.25 IC4.9 | R30.2 14.12,33.99 15.05,33.99 17.84,31.2 v21.65,31.2
N$7  (via drill 0.3)
  Top 0.406: v46.8,17.73 v46.8,24.21
  Bottom 0.406: IC3.2 46.29,13.86 46.29,16.08 46.8,16.59 v46.8,17.73 | C11.1 47.9,23.87 47.56,24.21 v46.8,24.21 45.4,24.21 44.42,23.23 R15.2
N$8
  Bottom 0.61: JP8.10 JP8.9 6.24,86.23 Q1.3
N$9
  Bottom 0.406: IC2.2 8.17,13.91 7.78,13.52 6.26,13.52 5.51,14.27 R2.1 5.14,17.31 R1.2
N$10  (via drill 0.3)
  Top 0.406: v8.19,29.67 8.19,25.86 8.7,25.35 8.7,19 7.68,17.99 v7.68,6.56
  Bottom 0.406: IC2.7 8.17,8.83 7.68,8.34 v7.68,6.56 7.68,5.8 7.17,5.29 5.9,5.29 5.56,4.95 R11.1 | R10.2 8.19,31.87 v8.19,29.67
N$11
  Bottom 0.406: IC3.3 47.43,12.15 46.92,11.64 44.76,11.64 43.49,12.91 43.49,14.69 42.1,16.08 38.92,16.08 37.53,17.48 37.53,19.89 38.92,21.29 38.92,24.34 38.33,24.93 C21.1 | 37.53,25.23 C21.1 | R18.2 25.37,29.67 34.35,29.67 35.37,28.66 35.37,25.1 35.53,24.93 C21.1
N$12
  Bottom 0.61: Q2.3 8.44,91.9 6.66,93.68 6.66,95.97 JP8.1 JP8.2
N$13
  Bottom 0.406: R8.2 37.82,43.39 36.99,43.39 35.98,42.37 34.69,42.37 34.45,42.12 | 34.45,42.12 R23.1 | IC4.2 31.81,45.52 32.22,45.12 32.22,43.64 32.67,43.19 32.72,43.19 32.72,42.52 33.03,42.22 | 33.03,42.22 34.35,42.22 34.45,42.12 | 33.03,42.22 33.03,41.15 33.08,41.1 32.06,40.09 32.06,38.82 31.3,38.05 28.51,38.05 27.75,37.29 22.16,37.29 21.65,37.8 21.65,39.07 20.13,40.59 20.13,52.53 19.28,53.38 R9.2
N$14
  Bottom 0.406: R9.1 13.65,51.55 POTX_L.2
N$15
  Bottom 0.406: R17.2 C13.1 30.12,28.91 27.75,28.91 27.24,28.4 27.24,27.13 26.78,26.67 24.3,26.67 R18.1 R19.2
N$16
  Bottom 0.406: R39.2 52.13,66.03 52.13,63.28 D1.3 51.2,61.68 52.44,61.68 54.62,59.49 54.62,48.27 52.94,46.59 50.4,46.59 49.74,47.25 47.34,47.25 R40.1
N$17
  Bottom 0.406: IC4.1 33.08,45.88 34.05,44.91 34.05,44.66 | 34.05,44.66 34.05,44.03 R23.2 | R40.2 35.23,45.84 34.05,44.66
N$18  (via drill 0.3)
  Top 0.406: v45.78,26.62 45.78,26.12 46.29,25.61 47.56,25.61 48.07,25.1 48.07,16.46 47.3,15.7 46.54,15.7 45.78,14.94 v45.78,5.8
  Bottom 0.406: R27.1 C16.2 44.93,4.18 45.78,5.03 v45.78,5.8 45.78,6.81 46.16,7.19 IC3.7 | R28.2 46.03,27.64 45.78,27.39 v45.78,26.62
N$19  (via drill 0.3)
  Top 0.406: CVX_R.P$3 21.29,1.08 20.48,1.88 20.48,35.11 21.65,36.28 v21.65,40.72
  Bottom 0.406: R31.1 21.61,43.73 20.89,43.01 20.89,41.48 v21.65,40.72 21.65,40.59
N$20
  Bottom 0.406: 26.73,45.67 IC4.6 26.73,43.03 25.73,42.03 R24.1 | R31.2 R24.1 | R24.1 24.44,41.01 24.44,38.69 24.82,38.31 27.24,38.31 28.51,39.58 R32.2
N$21  (via drill 0.3)
  Top 0.406: POTX_R.2 42.22,58.12 39.94,60.41 36.89,60.41 35.93,61.37 35.93,71.78 35.26,72.45 29.68,72.45 29.02,71.78 29.02,69.55 29.78,68.79 31.3,68.79 31.81,68.28 v31.81,41.61
  Bottom 0.406: R32.1 30.37,40.17 v31.81,41.61
N$22
  Bottom 0.406: R42.2 25.18,46.35 IC4.7 R24.2
N$23
  Bottom 0.406: R42.1 24.38,48.05 25.05,48.72 27.29,48.72 28,49.43 37.45,49.43 39.33,51.31 43.6,51.31 44.51,52.23 44.51,57.97 45.88,59.34 46.69,59.34 47.66,60.3 47.66,62.18 | 47.66,62.18 D2.3 | 47.66,62.18 48.47,63 48.47,63.81 49.59,64.93 R41.2
N$24
  Bottom 0.406: R25.1 49.5,32.05 50.61,30.94 50.61,28.82 R28.1 | R25.1 49.08,32.2 | C18.1 48.74,35.26 48.22,35.26 47.87,34.91 47.87,34.5 | R26.2 8.95,43.13 9.2,43.13 12.51,43.13 13.27,42.37 13.27,38.31 16.32,35.26 34.86,35.26 35.62,34.5 47.87,34.5 | R25.1 48.71,32.41 48.47,32.41 47.87,33.02 47.87,34.5
N$25
  Bottom 0.61: CVY_L.P$3 40.14,13.78 R33.1
N$26  (via drill 0.3)
  Top 0.406: v47.05,29.8 47.05,28.2 47.81,27.44 48.52,27.44 49.44,26.52 49.44,13.26 49.44,12.91 49.44,6.91 v47.94,5.42
  Bottom 0.406: C16.1 47.3,3.51 47.94,4.14 v47.94,5.42 47.94,6.56 47.43,7.07 IC3.6 | R25.2 47.6,30.35 v47.05,29.8
N$27
  Bottom 0.406: POTY_L.2 13.78,30.43 R30.1
N$28
  Bottom 0.406: IC4.8 25.41,51.88 25.41,52.73 24.55,53.6 24.55,62.29 25.21,62.95 R35.2 | R35.2 31.47,62.27 32.32,61.42 34.86,61.42 35.37,61.93 35.37,63.45 36.38,64.47 38.41,64.47 39.09,63.8 R47.2 | 31.21,62.69 R35.2
N$29
  Bottom 0.406: 46.34,72.34 47.05,72.34 48.07,73.36 R46.2 | 46.34,72.34 46.12,72.34 D3.3 46.9,71.06 46.9,65.72 46.16,64.98 43.24,64.98 41.21,62.95 R47.1 | 46.39,72.29 46.34,72.34
N$30  (via drill 0.3)
  Top 0.406: v50.45,10.93 51.88,12.35 51.88,16.46 50.73,17.61 50.73,20.4 51.37,21.04 v51.37,32.21
  Bottom 0.406: C22.1 50.1,7.13 | 50.1,7.13 IC3.5 | v51.37,32.21 R20.2 | 50.1,7.13 50.1,10.57 v50.45,10.93
N$31  (via drill 0.3)
  Top 0.406: CVY_R.P$3 38.3,1.08 37.14,2.24 37.14,31.3 35.87,32.57 35.87,36.53 34.73,37.67 v34.73,53.93
  Bottom 0.406: R37.1 34.73,56.05 v34.73,53.93
N$32
  Bottom 0.406: R20.1 51.37,37.71 R21.2 C14.1 42.99,40.51 42.99,36.53 41.97,35.51 36.38,35.51 35.62,36.28 20.89,36.28 20.38,36.78 20.38,39.07 18.86,40.59 18.86,46.44 17.84,47.45 8.78,47.45 R22.2
N$33
  Bottom 0.406: IC4.13 31.81,54.31 31.47,54.65 R34.1 R37.2 R38.2
N$34  (via drill 0.3)
  Top 0.406: v37.4,63.2 41.72,63.2 42.22,62.69 42.22,60.15 43.24,59.14 43.24,53.29 43.75,52.79 46.03,52.79 46.8,52.02 46.8,48.09 45.91,47.2 42.99,47.2 42.22,46.44 POTY_R.2
  Bottom 0.406: R38.1 35.87,59.9 36.64,60.66 36.64,62.44 v37.4,63.2
N$35
  Bottom 0.406: IC4.14 33.08,52.28 | 33.08,52.28 33.08,55.75 R34.2 | R52.2 39.09,59.22 39.94,58.37 39.94,55.58 38.67,54.31 36.64,54.31 35.87,53.55 35.87,52.79 35.37,52.28 33.08,52.28
N$36
  Bottom 0.406: 46.12,79.2 D4.3 R51.2 47.98,79.16 49.08,78.06 49.08,77.3 49.59,76.79 50.61,76.79 51.24,76.15 51.24,74.88 50.86,74.5 50.86,72.22 50.61,71.96 48.78,71.96 47.66,70.84 47.66,65.38 46.49,64.22 44.13,64.22 43.49,63.58 43.49,61.68 42.48,60.66 R52.1 40.83,60.91
N$39
  Bottom 0.406: IC3.1 44.89,14.69 44.76,14.81 44.76,18.88 45.91,20.02 R13.1 C11.2 45.57,21.92 42.73,21.92 42.35,22.31 42.35,24.97 40.19,27.13 37.14,27.13 36.38,27.89 36.38,29.93 35.62,30.69 25.37,30.69 R14.2
N$41
  Bottom 0.406: R16.2 9.97,40.59 11.74,38.82 11.74,37.29 13.52,35.51 14.79,35.51 16.57,33.74 24.02,33.74 R14.1 26.64,33.57 26.98,33.23 26.98,31.96 27.24,31.7 30.37,31.7 C10.1 30.63,31.96 37.14,31.96 37.91,31.2 37.91,28.91 38.67,28.15 40.6,28.15 43.75,25 R15.1
N$45
  Bottom 0.406: POTFM_L.2 13.65,70.86 R54.1
N$47
  Bottom 0.406: R56.2 38.67,83.52 37.02,85.17 IC6.1 37.14,86.13 37.14,87.79 39.12,89.77 43.56,89.77 R57.2
N$48
  Bottom 0.406: R57.1 48.83,88.94 R58.2 51.46,88.94 53.74,91.22 D5.3
N$49
  Bottom 0.406: POTFM_R.2 41.97,68.65 41.97,69.93 41.08,70.82 R59.1
N$50  (via drill 0.3)
  Top 0.406: v33.84,95.71 33.84,77.93 34.35,77.42 v34.86,77.42
  Bottom 0.406: IC6.6 34.48,92.79 33.84,93.43 v33.84,95.71 33.84,97.83 R61.1 | R43.2 36.98,78.53 35.87,77.42 v34.86,77.42 34.86,71.84 34.6,71.58 34.6,69.8 33.97,69.17 27.36,69.17 26.98,69.55 19.62,69.55 15.05,74.12 12.51,74.12 10.35,71.96 10.35,70.19 9.33,69.17 9.33,67.64 10.09,66.88 35.75,66.88 36.64,67.77 36.64,70.06 37.14,70.57 38.83,70.57 R59.2
N$51  (via drill 0.3)
  Top 0.406: FM_R.P$3 18.71,1.08 19.57,1.94 19.57,35.72 20.63,36.78 20.63,38.56 19.36,39.83 19.36,43.9 20.89,45.42 v20.89,65.74
  Bottom 0.406: POTFM_R.3 44.72,67.22 44.21,66.7 42.17,66.7 41.21,65.74 v20.89,65.74
N$52
  Bottom 0.406: R62.2 R61.2 35.37,97.66 35.37,93.93 35.75,93.55 IC6.7
N$53
  Bottom 0.406: D6.3 52.21,98 | R63.2 55.43,89.96 55.43,96.98 54.33,98.08 D6.3 | D6.3 52.05,98 R62.1 | 52.13,98.51 D6.3
N$54
  Bottom 0.406: IC6.2 35.87,85.87 35.87,84.03 36.98,82.92 R36.2 37.83,80.38 R56.1 40.19,78.86 40.19,74.76 38.03,72.6 37.14,72.6 35.62,71.07 35.62,69.04 34.86,68.28 18.98,68.28 14.79,72.47 14.41,72.47 14.28,72.34 14.12,72.34 R54.2
N$57
  Top 0.406: POTFM_L.3 16.15,60.75 15.3,59.9 15.3,54.06 19.11,50.25 19.11,47.71 14.79,43.39 14.79,37.29 16.57,35.51 17.33,35.51 18.6,34.24 18.6,14.69 17.7,13.78 FM_L.P$3
OUT_L
  Bottom 0.406: OUT_L.P$3 53.4,15.45 52.89,15.96 50.61,15.96 50.1,16.46 50.1,19.26 49.34,20.02 R13.2
OUT_R
  Bottom 0.508: R27.2 46.78,1.08 OUT_R.P$3

### Text on the board
tPlace: -12V | WaveTable | 5v | Rebel Technology | gnd | 3v3
bPlace: -12V | BOOT | 5v | gnd | 3v3 | Rebel Technology | WaveTable